# EAGLE design power (EAGLE 9.6.2)
Assembly variants: basic
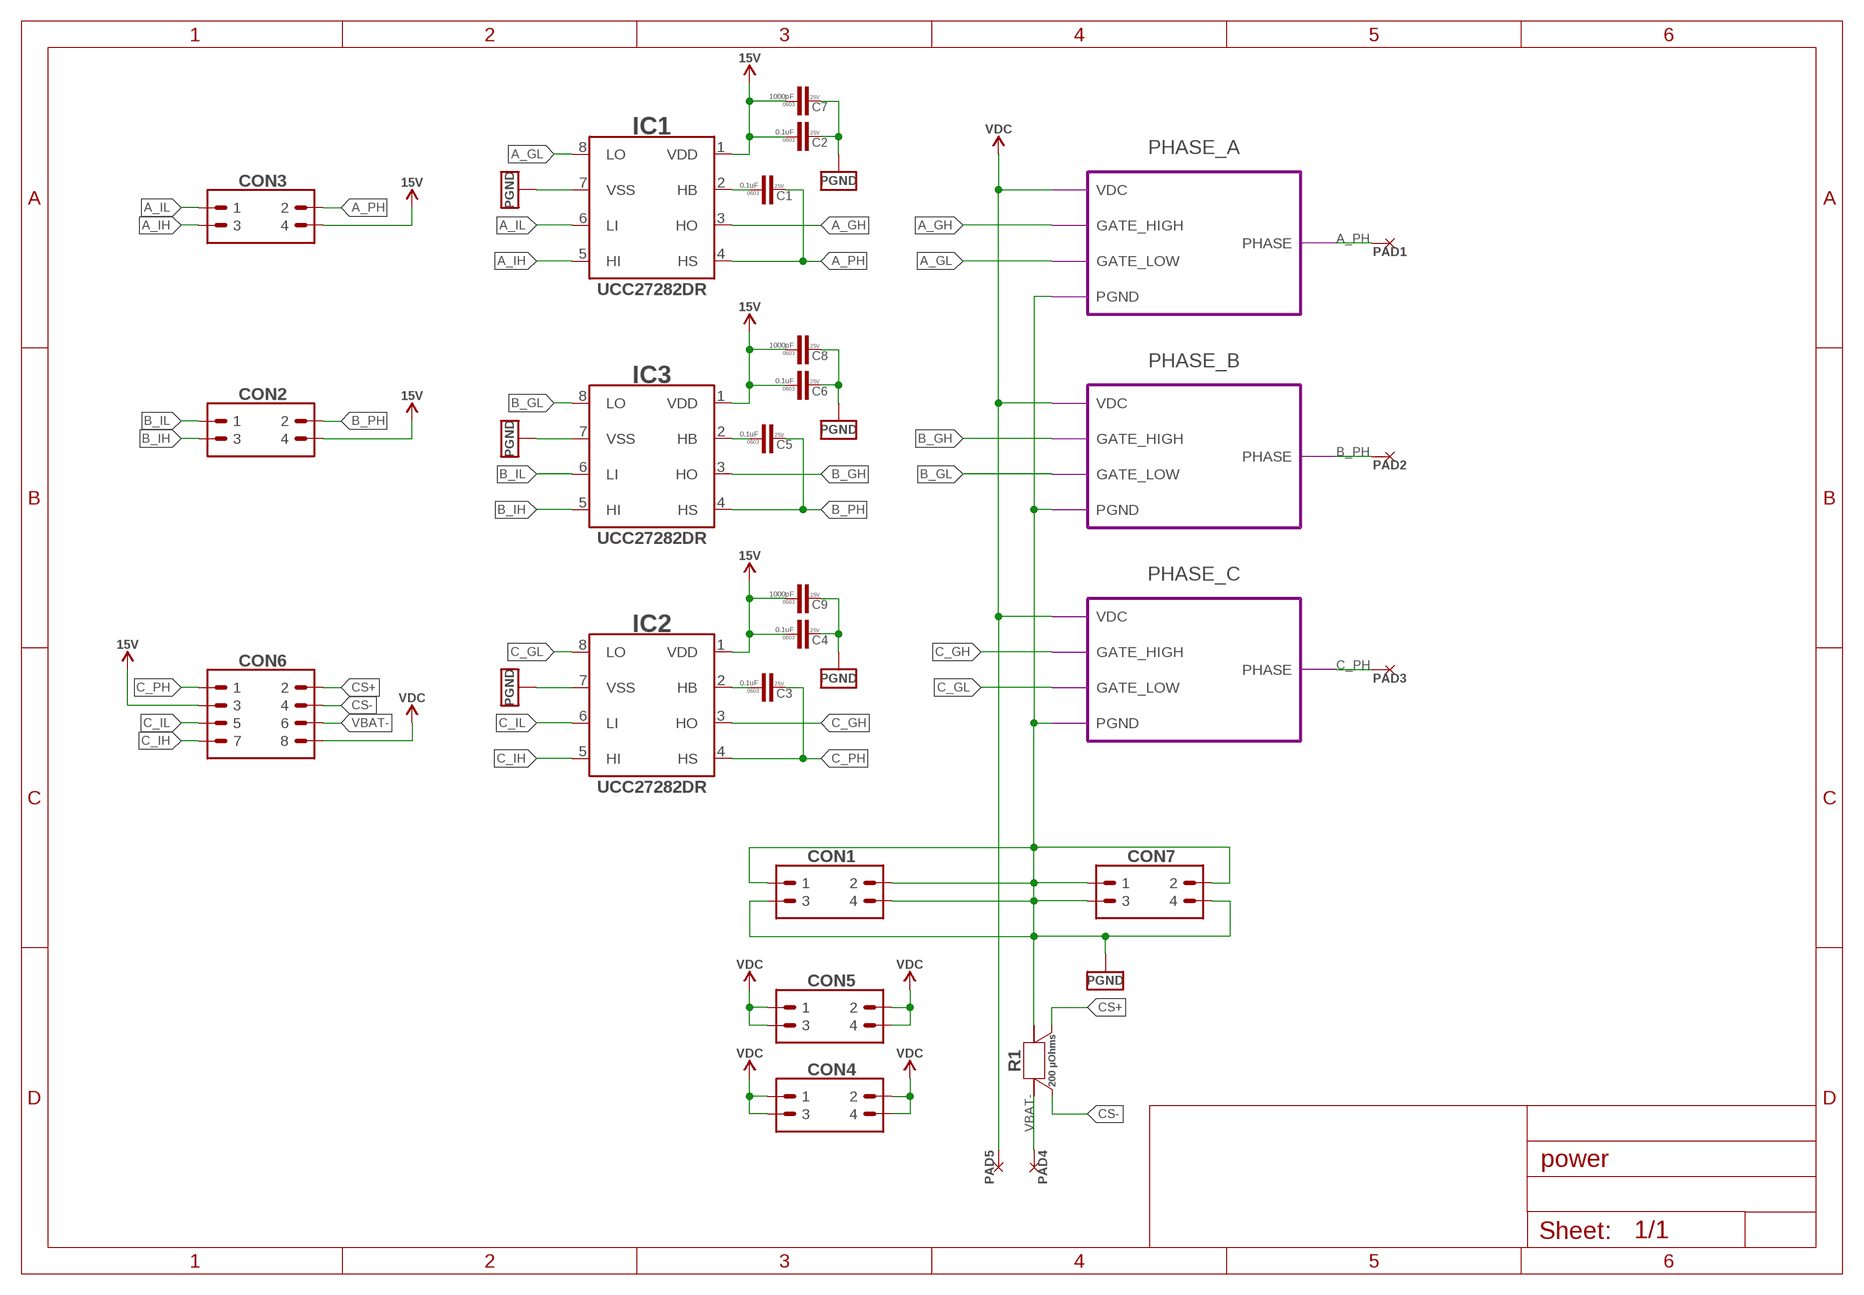
[diagram p0: schematic, sheet 1]

## Parts
C1  0.1uF  C-0603  [C0603]
C2  0.1uF  C-0603  [C0603]
C3  0.1uF  C-0603  [C0603]
C4  0.1uF  C-0603  [C0603]
C5  0.1uF  C-0603  [C0603]
C6  0.1uF  C-0603  [C0603]
C7  1000pF  C-0603  [C0603]
C8  1000pF  C-0603  [C0603]
C9  1000pF  C-0603  [C0603]
CON1  PINHEAD_2X02-0877590414  [2X02-SMD-2-MALE]
CON2  PINHEAD_2X02-0877590414  [2X02-SMD-2-MALE]
CON3  PINHEAD_2X02-0877590414  [2X02-SMD-2-MALE]
CON4  PINHEAD_2X02-0877590414  [2X02-SMD-2-MALE]
CON5  PINHEAD_2X02-0877590414  [2X02-SMD-2-MALE]
CON6  PINHEAD_2X04-SMD-2-MALE  [2X04-SMD-2-MALE]
CON7  PINHEAD_2X02-0877590414  [2X02-SMD-2-MALE]
IC1  UCC27282-SOIC8  [SOIC8]
IC2  UCC27282-SOIC8  [SOIC8]
IC3  UCC27282-SOIC8  [SOIC8]
PAD1  PAD-5X8  [5X8]  (not fitted in variant basic)
PAD2  PAD-5X8  [5X8]  (not fitted in variant basic)
PAD3  PAD-5X8  [5X8]  (not fitted in variant basic)
PAD4  PAD-5X4  [5X4]  (not fitted in variant basic)
PAD5  PAD-5X4  [5X4]  (not fitted in variant basic)
R1  200 µOhms  CURRENT_SHUNT_KELVIN-0.0002R-3920-KELVIN  [R3920-KELVIN]

## Module instances
PHASE_A = PHASE (part numbers offset by 100)
PHASE_B = PHASE (part numbers offset by 200)
PHASE_C = PHASE (part numbers offset by 300)

## Nets
A_GH [HV]: IC1.3(HO) ; port PHASE_A.GATE_HIGH
A_GL: IC1.8(LO) ; port PHASE_A.GATE_LOW
A_IH: CON3.3 IC1.5(HI)
A_IL: CON3.1 IC1.6(LI)
A_PH [HV]: C1.2 CON3.2 IC1.4(HS) PAD1.P$1 ; port PHASE_A.PHASE
B_GH [HV]: IC3.3(HO) ; port PHASE_B.GATE_HIGH
B_GL: IC3.8(LO) ; port PHASE_B.GATE_LOW
B_IH: CON2.3 IC3.5(HI)
B_IL: CON2.1 IC3.6(LI)
B_PH [HV]: C5.2 CON2.2 IC3.4(HS) PAD2.P$1 ; port PHASE_B.PHASE
C_GH [HV]: IC2.3(HO) ; port PHASE_C.GATE_HIGH
C_GL: IC2.8(LO) ; port PHASE_C.GATE_LOW
C_IH: CON6.7 IC2.5(HI)
C_IL: CON6.5 IC2.6(LI)
C_PH [HV]: C3.2 CON6.1 IC2.4(HS) PAD3.P$1 ; port PHASE_C.PHASE
CS+: CON6.2 R1.S2
CS-: CON6.4 R1.S1
N$1: C3.1 IC2.2(HB)
N$2: C5.1 IC3.2(HB)
N$13: C1.1 IC1.2(HB)
PGND: C2.2 C4.2 C6.2 C7.2 C8.2 C9.2 CON1.1 CON1.2 CON1.3 CON1.4 CON7.1 CON7.2 CON7.3 CON7.4 IC1.7(VSS) IC2.7(VSS) IC3.7(VSS) R1.2 R1.22 ; port PHASE_A.PGND PHASE_C.PGND PHASE_B.PGND
VBAT-: CON6.6 PAD4.P$1 R1.1 R1.11
VDC [HV]: CON4.1 CON4.2 CON4.3 CON4.4 CON5.1 CON5.2 CON5.3 CON5.4 CON6.8 PAD5.P$1 ; port PHASE_B.VDC PHASE_A.VDC PHASE_C.VDC
VDD_15V: C2.1 C4.1 C6.1 C7.1 C8.1 C9.1 CON2.4 CON3.4 CON6.3 IC1.1(VDD) IC2.1(VDD) IC3.1(VDD) ; supply symbol labelled 15V

## Library data of the parts
C1-C9 = rc:C; AEC-Q: ---; DIGIKEY#: 1276-1006-1-ND; MANF: Samsung Electro-Mechanics; MANF#: CL10B104KA8NNNC; OPERATING_TEMP: -55°C ~ 125°C; PACKAGE: 0603; VOLTAGE: 25V
CON1-CON5 CON7 = pinhead:PINHEAD_2X02; DIGIKEY#: WM18712-ND; MANF: Molex; MANF#: 0877590414
CON6 = pinhead:PINHEAD_2X04; DIGIKEY#: WM14802-ND; MANF: Molex; MANF#: 0877590814
IC1-IC3 = mosfet_drivers:UCC27282: 3-A, 120-V half bridge gate driver with 5-V UVLO and interlock protections; DIGIKEY#: 296-UCC27282DRCT-ND; MANF: Texas Instruments; MANF#: UCC27282DR
PAD1-PAD3 = PADS:PAD
PAD4 PAD5 = PADS:PAD; BOM: EXCLUDE
R1 = SHUNT_RESISTORS:CURRENT_SHUNT_KELVIN; DIGIKEY#: CSS2H-3920R-L200FCT-ND; LCSC#: C469432; MANF: Bourns Inc; MANF#: CSS2H-3920R-L200FCT-ND; OPERATING_TEMP: -55°C ~ 170°C; PACKAGE: 3920; POWER: 12W; TC: ±50ppm/°C; TOLERANCE: ±1%

## Module PHASE
Ports: GATE_HIGH(in) GATE_LOW(in) PHASE(io) PGND(pwr) VDC(pwr)
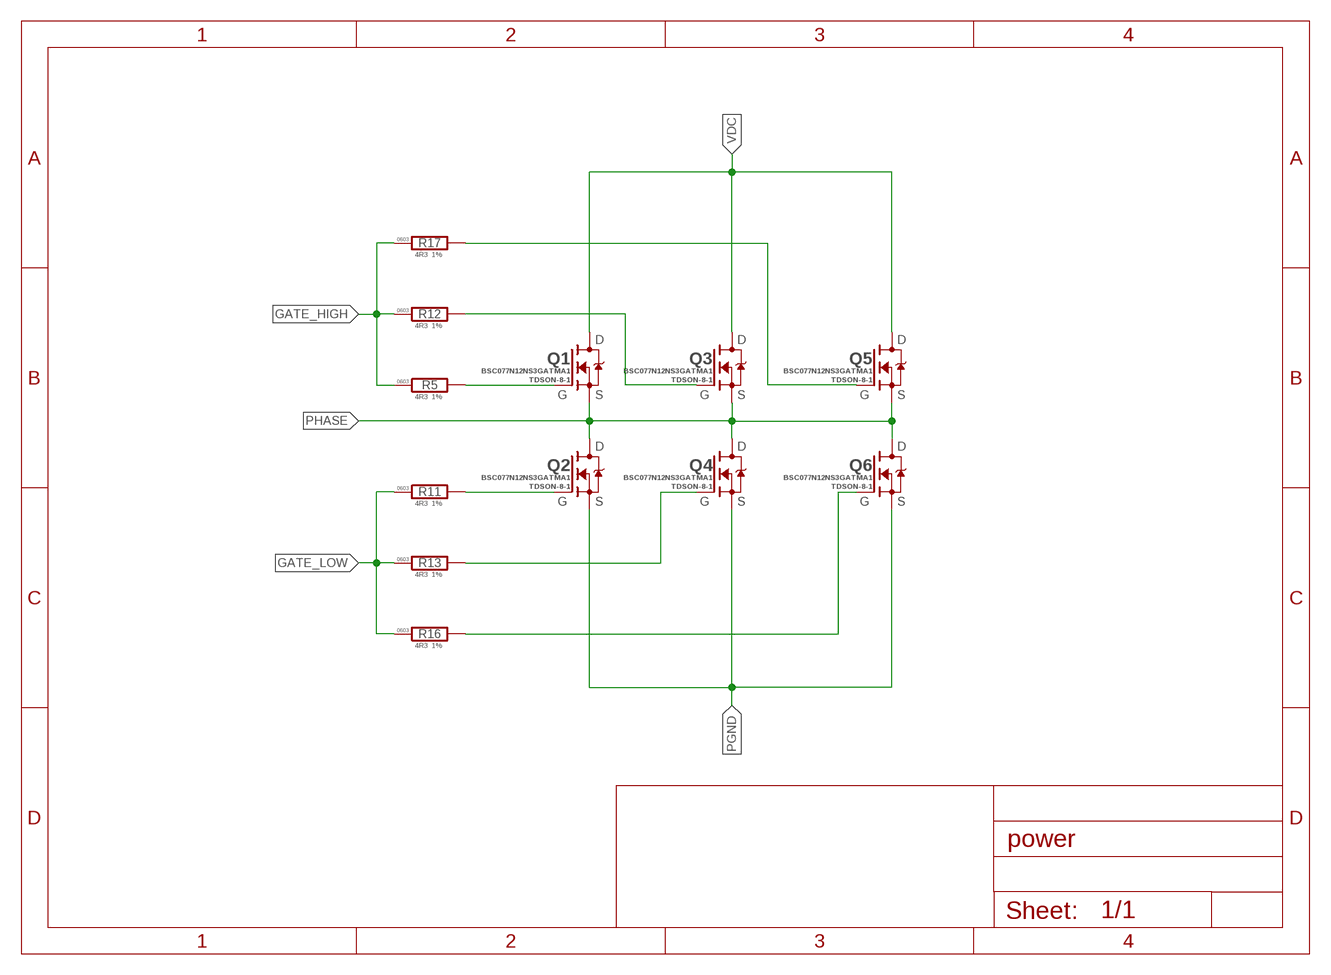
[diagram p1: schematic, module PHASE, sheet 1]

### Parts
Q1  BSC077N12NS3GATMA1  [PG-TDSON-8-1]
Q2  BSC077N12NS3GATMA1  [PG-TDSON-8-1]
Q3  BSC077N12NS3GATMA1  [PG-TDSON-8-1]
Q4  BSC077N12NS3GATMA1  [PG-TDSON-8-1]
Q5  BSC077N12NS3GATMA1  [PG-TDSON-8-1]
Q6  BSC077N12NS3GATMA1  [PG-TDSON-8-1]
R5  4R3  R-1%-0603  [R0603]
R11  4R3  R-1%-0603  [R0603]
R12  4R3  R-1%-0603  [R0603]
R13  4R3  R-1%-0603  [R0603]
R16  4R3  R-1%-0603  [R0603]
R17  4R3  R-1%-0603  [R0603]

### Nets
GATE_HIGH [HV]: R5.1 R12.1 R17.1
GATE_LOW: R11.1 R13.1 R16.1
N$1 [HV]: Q1.4(G) R5.2
N$2: Q2.4(G) R11.2
N$3 [HV]: Q3.4(G) R12.2
N$4: Q4.4(G) R13.2
N$5 [HV]: Q5.4(G) R17.2
N$6: Q6.4(G) R16.2
PGND: Q2.1(S) Q2.2(S) Q2.3(S) Q4.1(S) Q4.2(S) Q4.3(S) Q6.1(S) Q6.2(S) Q6.3(S)
PHASE [HV]: Q1.1(S) Q1.2(S) Q1.3(S) Q2.P$1(D) Q3.1(S) Q3.2(S) Q3.3(S) Q4.P$1(D) Q5.1(S) Q5.2(S) Q5.3(S) Q6.P$1(D)
VDC [HV]: Q1.P$1(D) Q3.P$1(D) Q5.P$1(D)

### Library data of the parts
Q1-Q6 = mosfet:BSC077N12NS3GATMA1: N-Channel 120V 13.4A (Ta), 98A (Tc) 139W (Tc) Surface Mount PG-TDSON-8-1; DIGIKEY#: BSC077N12NS3GATMA1CT-ND; MANF: Infineon Technologies; MANF#: BSC077N12NS3GATMA1; PACKAGE: TDSON-8-1
R5 R11-R13 R16 R17 = rc:R; AEC-Q: AEC-Q200; DIGIKEY#: 10-ERJ-U03F4R30VCT-ND; MANF: Panasonic Electronic Components; MANF#: ERJ-U03F4R30V; OPERATING_TEMP: -55°C ~ 155°C; PACKAGE: 0603; TOLERANCE: 1%

## Net classes
1 HV: clearance 0.4 mm to class 0, clearance 0.4 mm

## Board
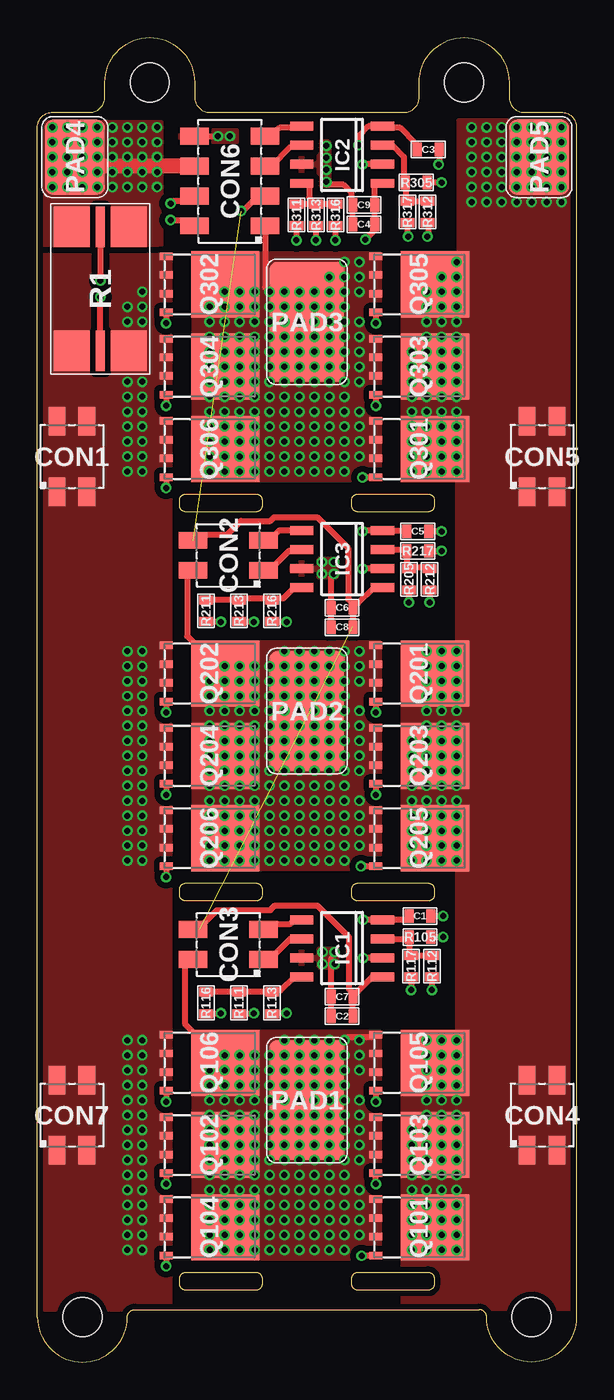
[diagram p2: board, top side]
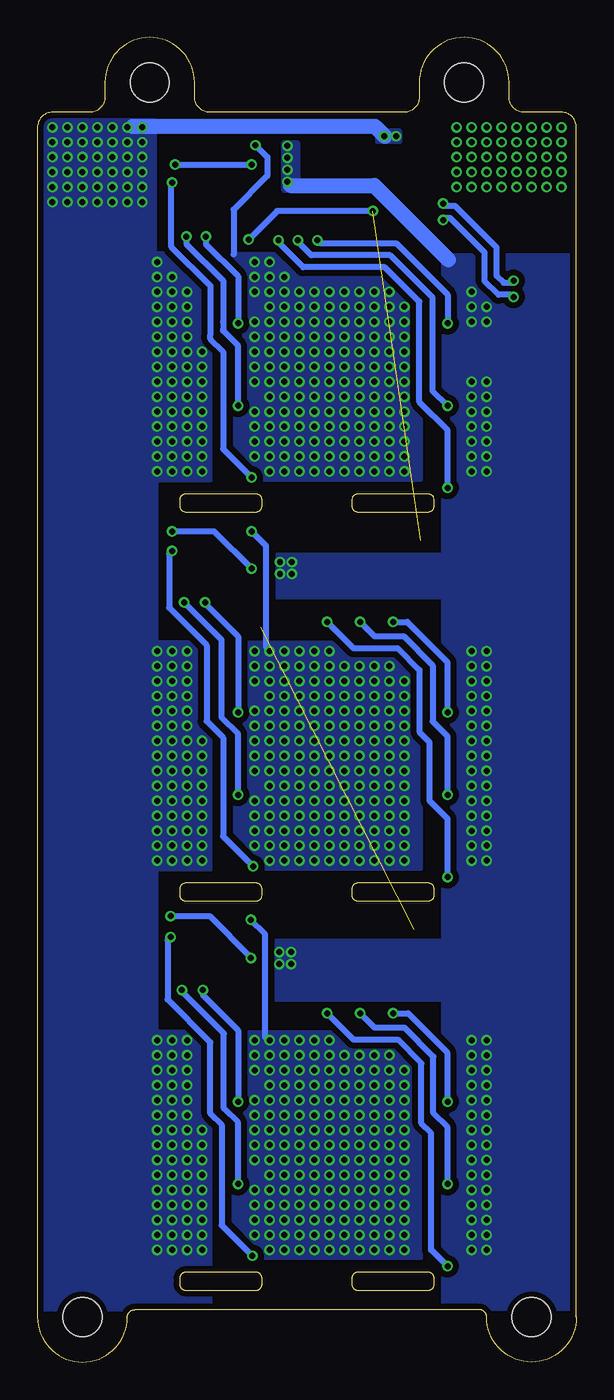
[diagram p3: board, bottom side, seen from below]

Size 36 x 88.5 mm. Coordinates in mm from the lower left corner, seen from the top.
Outline: 30,3 arc90 29.5,3.5 6.5,3.5 arc90 6,3 arc-90 3,0 arc-90 0,3 0,82.5 arc-90 1,83.5 3.5,83.5 arc90 4.5,84.5 4.5,85.5 arc-90 7.5,88.5 arc-90 10.5,85.5 10.5,84.5 arc90 11.5,83.5 24.5,83.5 arc90 25.5,84.5 25.5,85.5 arc-90 28.5,88.5 arc-90 31.5,85.5 31.5,84.5 arc90 32.5,83.5 35,83.5 arc-90 36,82.5 36,3 arc-90 33,0 arc-90 30,3
Outline: 9.9,58 14.6,58 arc-90 15,57.6 15,57.2 arc-90 14.6,56.8 9.9,56.8 arc-90 9.5,57.2 9.5,57.6 arc-90 9.9,58
Outline: 26.5,57.6 26.5,57.2 arc-90 26.1,56.8 21.4,56.8 arc-90 21,57.2 21,57.6 arc-90 21.4,58 26.1,58 arc-90 26.5,57.6
Outline: 9.9,32 14.6,32 arc-90 15,31.6 15,31.2 arc-90 14.6,30.8 9.9,30.8 arc-90 9.5,31.2 9.5,31.6 arc-90 9.9,32
Outline: 26.5,31.6 26.5,31.2 arc-90 26.1,30.8 21.4,30.8 arc-90 21,31.2 21,31.6 arc-90 21.4,32 26.1,32 arc-90 26.5,31.6
Outline: 9.9,6 14.6,6 arc-90 15,5.6 15,5.2 arc-90 14.6,4.8 9.9,4.8 arc-90 9.5,5.2 9.5,5.6 arc-90 9.9,6
Outline: 26.5,5.6 26.5,5.2 arc-90 26.1,4.8 21.4,4.8 arc-90 21,5.2 21,5.6 arc-90 21.4,6 26.1,6 arc-90 26.5,5.6
Copper layers (1*16): Top 0.035mm / dielectric 1mm / Bottom 0.035mm
Design rules "pwrpcb *": minimum track width 0.4mm, minimum drill 0.3mm, track to track 0.4mm, track to pad 0.4mm, pad to pad 0.4mm, via to via 0.4mm, smd to smd 0.15mm, copper to edge 0.4mm, drill to drill 0.4mm, minimum pad ring 0.15mm, minimum via ring 0.15mm, stop-mask expansion 0.41mm, vias tented up to drill 0.41mm, thermal gap 8mil
Holes 2.6 mm at 7.5,85.5 28.5,85.5 3,3 33,3

### Footprints (pad centres in the part's own frame; a part is rotated, then mirrored left to right if it is on the bottom)
C0603 = smd 0.6 x 0.9: 1 -0.725,0; 2 0.725,0
2X02-SMD-2-MALE = smd 1.9 x 1.12: 1 -2.35,1; 2 2.35,1; 3 -2.35,-1; 4 2.35,-1
2X04-SMD-2-MALE = smd 1.9 x 1.12: 1 -2.35,3; 2 2.35,3; 3 -2.35,1; 4 2.35,1; 5 -2.35,-1; 6 2.35,-1; 7 -2.35,-3; 8 2.35,-3
SOIC8 = smd 1.55 x 0.6: 1 -2.7,1.905; 2 -2.7,0.635; 3 -2.7,-0.635; 4 -2.7,-1.905; 5 2.7,-1.905; 6 2.7,-0.635; 7 2.7,0.635; 8 2.7,1.905
5X8 = smd 5 x 8: P$1 0,0
5X4 = smd 5 x 4: P$1 0,0
PG-TDSON-8-1 = smd 0.5 x 0.85: 1 -1.875,-2.9; 2 -0.625,-2.9; 3 0.625,-2.9; 4 1.875,-2.9 | smd 4.41 x 4.55: P$1 0,1.05
R3920-KELVIN = smd 2.7 x 2.4: 1 -4.15,1.9; 2 4.15,1.9; 11 -4.15,-1.9; 22 4.15,-1.9 | smd 2.7 x 0.6: S1 -4.15,0; S2 4.15,0
R0603 = smd 0.6 x 0.9: 1 -0.725,0; 2 0.725,0

### Placement (x,y rotation side)
C1  25.55,29.8 180 top
C2  20.35,23.1 180 top
C3  26.1,81 180 top
C4  21.8,76 180 top
C5  25.4,55.5 180 top
C6  20.35,50.4 180 top
C7  20.35,24.4 180 top
C8  20.35,49.1 180 top
C9  21.8,77.3 180 top
CON1  2.3,60.5 90 top
CON2  12.75,53.9 180 top
CON3  12.75,27.9 180 top
CON4  33.7,16.5 90 top
CON5  33.7,60.5 90 top
CON6  12.85,78.9 180 top
CON7  2.3,16.5 90 top
IC1  20.35,27.65 180 top
IC2  20.35,80.65 180 top
IC3  20.35,53.65 180 top
PAD1  18,17.5 180 top
PAD2  18,43.5 180 top
PAD3  18,69.5 180 top
PAD4  2.5,80.5 270 top
PAD5  33.5,80.5 270 top
Q101  BSC077N12NS3GATMA1  [PG-TDSON-8-1]  25.5,9 270 top
Q102  BSC077N12NS3GATMA1  [PG-TDSON-8-1]  11.5,14.5 270 top
Q103  BSC077N12NS3GATMA1  [PG-TDSON-8-1]  25.5,14.5 270 top
Q104  BSC077N12NS3GATMA1  [PG-TDSON-8-1]  11.5,9 270 top
Q105  BSC077N12NS3GATMA1  [PG-TDSON-8-1]  25.5,20 270 top
Q106  BSC077N12NS3GATMA1  [PG-TDSON-8-1]  11.5,20 270 top
Q201  BSC077N12NS3GATMA1  [PG-TDSON-8-1]  25.5,46 270 top
Q202  BSC077N12NS3GATMA1  [PG-TDSON-8-1]  11.5,46 270 top
Q203  BSC077N12NS3GATMA1  [PG-TDSON-8-1]  25.5,40.5 270 top
Q204  BSC077N12NS3GATMA1  [PG-TDSON-8-1]  11.5,40.5 270 top
Q205  BSC077N12NS3GATMA1  [PG-TDSON-8-1]  25.5,35 270 top
Q206  BSC077N12NS3GATMA1  [PG-TDSON-8-1]  11.5,35 270 top
Q301  BSC077N12NS3GATMA1  [PG-TDSON-8-1]  25.5,61 270 top
Q302  BSC077N12NS3GATMA1  [PG-TDSON-8-1]  11.5,72 270 top
Q303  BSC077N12NS3GATMA1  [PG-TDSON-8-1]  25.5,66.5 270 top
Q304  BSC077N12NS3GATMA1  [PG-TDSON-8-1]  11.5,66.5 270 top
Q305  BSC077N12NS3GATMA1  [PG-TDSON-8-1]  25.5,72 270 top
Q306  BSC077N12NS3GATMA1  [PG-TDSON-8-1]  11.5,61 270 top
R1  4.2,71.7 270 top
R105  4R3  [R0603]  25.55,28.4 0 top
R111  4R3  [R0603]  13.45,24 270 top
R112  4R3  [R0603]  26.35,26.45 270 top
R113  4R3  [R0603]  15.65,24 270 top
R116  4R3  [R0603]  11.25,24 270 top
R117  4R3  [R0603]  24.95,26.45 270 top
R205  4R3  [R0603]  24.8,52.3 270 top
R211  4R3  [R0603]  11.25,50.2 270 top
R212  4R3  [R0603]  26.2,52.3 270 top
R213  4R3  [R0603]  13.45,50.2 270 top
R216  4R3  [R0603]  15.65,50.2 270 top
R217  4R3  [R0603]  25.4,54.2 0 top
R305  4R3  [R0603]  25.3,78.8 0 top
R311  4R3  [R0603]  17.3,76.65 270 top
R312  4R3  [R0603]  26.05,76.85 270 top
R313  4R3  [R0603]  18.6,76.65 270 top
R316  4R3  [R0603]  19.9,76.65 270 top
R317  4R3  [R0603]  24.7,76.85 270 top

### Tracks (layer width: path | path; a pad name or v marks a point on that pad's centre or on a via)
A_GH
  Top 0.4: R112.1 R117.1 24.82,27.3 R105.1 24.71,28.29 IC1.3
A_GL
  Top 0.4: R116.1 R111.1 R113.1 15.75,24.82 16.23,24.82 17.15,25.75 IC1.8
A_IH
  Top 0.4: IC1.5 17.16,29.55 16.85,29.25 15.45,29.25 CON3.3
A_IL
  Top 0.4: CON3.1 15.45,27.25 15.87,27.25 16.9,28.29 IC1.6
A_PH  (via drill 0.4 pad 0.7)
  Top 0.4: CON3.2 9.9,26.9 9.85,26.85 9.85,22.6 12.45,20 Q106.P$1 | v21.75,29.55 IC1.4 24.82,29.55 C1.2 | Q105.1 22.43,21.7 20.7,21.7
  Bottom 0.4: 20.8,21.7 20.8,28.6 v21.75,29.55
  other vias: 20.5,21.5 21.5,21.5 20.5,20.5 21.5,20.5 19.5,20.5 20.5,19.5 21.5,19.5 19.5,19.5 18.5,19.5 17.5,19.5 16.5,19.5 15.5,19.5 14.5,19.5 13.5,19.5 12.5,19.5 20.5,18.5 19.5,18.5 18.5,18.5 17.5,18.5 16.5,18.5 15.5,18.5 14.5,18.5 13.5,18.5 12.5,18.5 11.5,18.5 20.5,17.5 21.5,17.5 19.5,17.5 18.5,17.5 17.5,17.5 16.5,17.5 15.5,17.5 14.5,17.5 13.5,17.5 12.5,17.5 11.5,17.5 20.5,16.5 21.5,16.5 19.5,16.5 18.5,16.5 17.5,16.5 16.5,16.5 15.5,16.5 14.5,16.5 13.5,16.5 12.5,16.5 11.5,16.5 20.5,15.5 21.5,15.5 19.5,15.5 18.5,15.5 17.5,15.5 16.5,15.5 15.5,15.5 14.5,15.5 13.5,15.5 12.5,15.5 11.5,15.5 20.5,8.5 21.5,8.5 19.5,8.5 18.5,8.5 17.5,8.5 16.5,8.5 15.5,8.5 14.5,8.5 13.5,8.5 12.5,8.5 11.5,8.5 20.5,7.5 19.5,7.5 18.5,7.5 17.5,7.5 16.5,7.5 15.5,7.5 14.5,7.5 13.5,7.5 12.5,7.5 11.5,7.5 20.5,11.5 21.5,11.5 19.5,11.5 18.5,11.5 17.5,11.5 16.5,11.5 15.5,11.5 14.5,11.5 13.5,11.5 12.5,11.5 11.5,11.5 20.5,10.5 21.5,10.5 19.5,10.5 18.5,10.5 17.5,10.5 16.5,10.5 15.5,10.5 14.5,10.5 13.5,10.5 12.5,10.5 11.5,10.5 20.5,9.5 21.5,9.5 19.5,9.5 18.5,9.5 17.5,9.5 16.5,9.5 15.5,9.5 14.5,9.5 13.5,9.5 12.5,9.5 11.5,9.5 20.5,14.5 21.5,14.5 19.5,14.5 18.5,14.5 17.5,14.5 16.5,14.5 15.5,14.5 14.5,14.5 13.5,14.5 12.5,14.5 11.5,14.5 20.5,13.5 21.5,13.5 19.5,13.5 18.5,13.5 17.5,13.5 16.5,13.5 15.5,13.5 14.5,13.5 13.5,13.5 12.5,13.5 11.5,13.5 20.5,12.5 19.5,12.5 18.5,12.5 17.5,12.5 16.5,12.5 15.5,12.5 14.5,12.5 13.5,12.5 12.5,12.5 11.5,12.5 18.5,20.5 17.5,20.5 16.5,20.5 15.5,20.5 14.5,20.5 13.5,20.5 12.5,20.5 11.5,19.5 18.5,21.5 17.5,21.5 16.5,21.5 19.5,21.5
  pour Top (no thermals): 10.38,22.1 10.38,6.9 22.93,6.9 22.93,22.1
  pour Bottom (no thermals): 10.38,22.1 10.38,6.9 22.93,6.9 22.93,22.1
B_GH
  Top 0.4: R212.1 26.15,53.08 24.85,53.08 R205.1 24.7,53.02 24.68,53.05 R217.1 24.59,54.28 IC3.3
B_GL
  Top 0.4: R216.1 15.55,51.02 | 15.55,51.02 15,51.02 13.55,51.02 R213.1 R211.1 | IC3.8 17.14,51.74 16.43,51.02 15.55,51.02
B_IH
  Top 0.4: IC3.5 16.16,55.55 15.5,54.9 CON2.3
B_IL
  Top 0.4: CON2.1 15.5,52.9 16.79,54.19 17.55,54.19 IC3.6
B_PH  (via drill 0.4 pad 0.7)
  Top 0.4: CON2.2 10,52.5 10,48.5 12.5,46 Q202.P$1 | C5.2 24.62,55.55 IC3.4 21.75,55.55 v21.7,55.5
  Bottom 0.4: v21.7,55.5 20.75,54.55 20.75,47.8
  other vias: 20.5,47.5 21.5,47.5 20.5,46.5 21.5,46.5 19.5,46.5 20.5,45.5 21.5,45.5 19.5,45.5 18.5,45.5 17.5,45.5 16.5,45.5 15.5,45.5 14.5,45.5 13.5,45.5 12.5,45.5 20.5,44.5 19.5,44.5 18.5,44.5 17.5,44.5 16.5,44.5 15.5,44.5 14.5,44.5 13.5,44.5 12.5,44.5 11.5,44.5 20.5,43.5 21.5,43.5 19.5,43.5 18.5,43.5 17.5,43.5 16.5,43.5 15.5,43.5 14.5,43.5 13.5,43.5 12.5,43.5 11.5,43.5 20.5,42.5 21.5,42.5 19.5,42.5 18.5,42.5 17.5,42.5 16.5,42.5 15.5,42.5 14.5,42.5 13.5,42.5 12.5,42.5 11.5,42.5 20.5,41.5 21.5,41.5 19.5,41.5 18.5,41.5 17.5,41.5 16.5,41.5 15.5,41.5 14.5,41.5 13.5,41.5 12.5,41.5 11.5,41.5 20.5,34.5 21.5,34.5 19.5,34.5 18.5,34.5 17.5,34.5 16.5,34.5 15.5,34.5 14.5,34.5 13.5,34.5 12.5,34.5 11.5,34.5 20.5,33.5 19.5,33.5 18.5,33.5 17.5,33.5 16.5,33.5 15.5,33.5 14.5,33.5 13.5,33.5 12.5,33.5 11.5,33.5 20.5,37.5 21.5,37.5 19.5,37.5 18.5,37.5 17.5,37.5 16.5,37.5 15.5,37.5 14.5,37.5 13.5,37.5 12.5,37.5 11.5,37.5 20.5,36.5 21.5,36.5 19.5,36.5 18.5,36.5 17.5,36.5 16.5,36.5 15.5,36.5 14.5,36.5 13.5,36.5 12.5,36.5 11.5,36.5 20.5,35.5 21.5,35.5 19.5,35.5 18.5,35.5 17.5,35.5 16.5,35.5 15.5,35.5 14.5,35.5 13.5,35.5 12.5,35.5 11.5,35.5 20.5,40.5 21.5,40.5 19.5,40.5 18.5,40.5 17.5,40.5 16.5,40.5 15.5,40.5 14.5,40.5 13.5,40.5 12.5,40.5 11.5,40.5 20.5,39.5 21.5,39.5 19.5,39.5 18.5,39.5 17.5,39.5 16.5,39.5 15.5,39.5 14.5,39.5 13.5,39.5 12.5,39.5 11.5,39.5 20.5,38.5 19.5,38.5 18.5,38.5 17.5,38.5 16.5,38.5 15.5,38.5 14.5,38.5 13.5,38.5 12.5,38.5 11.5,38.5 17.5,46.5 18.5,46.5 19.5,47.5 17.5,47.5 18.5,47.5 16.5,47.5 16.5,46.5 15.5,46.5 14.5,46.5 13.5,46.5 12.5,46.5 11.5,45.5
  pour Top (no thermals): 10.38,48.1 10.38,32.9 22.93,32.9 22.93,48.1
  pour Bottom (no thermals): 10.38,48.1 10.38,32.9 22.93,32.9 22.93,48.1
C_GH
  Top 0.4: IC2.3 23.71,81.28 24.48,80.53 24.48,78.9 R305.1 24.6,78.78 24.6,77.67 R317.1 R312.1
C_GL
  Top 0.4: R316.1 R313.1 | R313.1 R311.1 | R313.1 18.15,77.83 18.15,78.75 IC2.8
C_IH
  Top 0.4: IC2.5 17.55,82.45 16.16,82.45 15.6,81.9 CON6.7
C_IL
  Top 0.4: CON6.5 15.6,79.9 16.89,81.19 17.55,81.19 IC2.6
C_PH  (via drill 0.4 pad 0.7)
  Top 0.4: 22.85,73.92 22.8,73.88 Q305.1 | C3.2 25.27,81.1 25.27,81.4 24.22,82.45 23.15,82.45 IC2.4 22.11,82.56 21.45,81.9 v21.45,81.3 | Q304.P$1 14,66.5 | CON6.1 15.2,71.8 v15.5,71.5
  Bottom 0.4: v21.45,81.3 20.65,80.5 20.65,79.25 22.9,77 22.9,74
  other vias: 20.5,73.5 21.5,73.5 20.5,72.5 21.5,72.5 19.5,72.5 20.5,71.5 21.5,71.5 19.5,71.5 18.5,71.5 17.5,71.5 16.5,71.5 14.5,71.5 13.5,71.5 12.5,71.5 20.5,70.5 19.5,70.5 18.5,70.5 17.5,70.5 16.5,70.5 15.5,70.5 14.5,70.5 13.5,70.5 12.5,70.5 11.5,70.5 20.5,69.5 21.5,69.5 19.5,69.5 18.5,69.5 17.5,69.5 16.5,69.5 15.5,69.5 14.5,69.5 13.5,69.5 12.5,69.5 11.5,69.5 20.5,68.5 21.5,68.5 19.5,68.5 18.5,68.5 17.5,68.5 16.5,68.5 15.5,68.5 14.5,68.5 13.5,68.5 12.5,68.5 11.5,68.5 20.5,67.5 21.5,67.5 19.5,67.5 18.5,67.5 17.5,67.5 16.5,67.5 15.5,67.5 14.5,67.5 13.5,67.5 12.5,67.5 11.5,67.5 20.5,60.5 21.5,60.5 19.5,60.5 18.5,60.5 17.5,60.5 16.5,60.5 15.5,60.5 14.5,60.5 13.5,60.5 12.5,60.5 11.5,60.5 20.5,59.5 19.5,59.5 18.5,59.5 17.5,59.5 16.5,59.5 15.5,59.5 14.5,59.5 13.5,59.5 12.5,59.5 11.5,59.5 20.5,63.5 21.5,63.5 19.5,63.5 18.5,63.5 17.5,63.5 16.5,63.5 15.5,63.5 14.5,63.5 13.5,63.5 12.5,63.5 11.5,63.5 20.5,62.5 21.5,62.5 19.5,62.5 18.5,62.5 17.5,62.5 16.5,62.5 15.5,62.5 14.5,62.5 13.5,62.5 12.5,62.5 11.5,62.5 20.5,61.5 21.5,61.5 19.5,61.5 18.5,61.5 17.5,61.5 16.5,61.5 15.5,61.5 14.5,61.5 13.5,61.5 12.5,61.5 11.5,61.5 20.5,66.5 21.5,66.5 19.5,66.5 18.5,66.5 17.5,66.5 16.5,66.5 15.5,66.5 14.5,66.5 13.5,66.5 12.5,66.5 11.5,66.5 20.5,65.5 21.5,65.5 19.5,65.5 18.5,65.5 17.5,65.5 16.5,65.5 15.5,65.5 14.5,65.5 13.5,65.5 12.5,65.5 11.5,65.5 20.5,64.5 19.5,64.5 18.5,64.5 17.5,64.5 16.5,64.5 15.5,64.5 14.5,64.5 13.5,64.5 12.5,64.5 11.5,64.5
  pour Top (no thermals): 10.38,74.1 10.38,58.9 22.93,58.9 22.93,74.1
  pour Bottom (no thermals): 10.38,74.1 10.38,58.9 22.93,58.9 22.93,74.1
CS+  (via drill 0.4 pad 0.7)
  Top 0.4: R1.S2 v4.2,71.15 | CON6.2 10.15,76.25 8.95,76.25 v8.9,76.3
  Bottom 0.4: v8.9,76.3 8.75,76.45 8.45,76.45 6.15,74.15 6.15,72.25 5.2,71.3 4.35,71.3 v4.2,71.15
CS-  (via drill 0.4 pad 0.7)
  Top 0.4: R1.S1 v4.2,72.25 | CON6.4 10.15,77.55 9.05,77.55 v8.9,77.4
  Bottom 0.4: v8.9,77.4 8.75,77.25 8.12,77.25 5.35,74.48 5.35,72.58 4.87,72.1 4.35,72.1 v4.2,72.25
N$1  (via drill 0.4 pad 0.7)
  Top 0.4: IC2.2 21.71,80.02 v21.7,80 | C3.1 26.82,80.03 v26.8,80
  Bottom 0.4: v26.8,80 v21.7,80
N$2  (via drill 0.4 pad 0.7)
  Top 0.4: IC3.2 23.04,53 v21.7,53 | v27,55.5 C5.1
  Bottom 0.4: v21.7,53 24.2,55.5 v27,55.5
N$13  (via drill 0.4 pad 0.7)
  Top 0.4: IC1.2 21.77,27.02 v21.75,27 | C1.1 v27.1,29.8
  Bottom 0.4: v21.75,27 21.75,27.05 24.5,29.8 v27.1,29.8
PGND  (via drill 0.4 pad 0.7)
  Top 0.4: C2.2 C7.2 19.57,24.3 19.6,24.32 19.6,26.95 | C8.2 C6.2 19.62,52.48 v19.8,52.65 | C4.2 C9.2 20.98,77.4 20.98,78.12 20.45,78.65 19.3,78.65 v19.3,78.85
  Bottom 1: 19.1,78.6 13.5,78.6 8.55,73.65
  other vias: 19.05,27.4 19.3,80.45 19,53.45 19.8,53.45 19,52.65 19.85,27.4 19.05,26.6 19.85,26.6 19.3,81.25 19.3,79.65 7,21.5 7,20.5 7,19.5 7,18.5 7,17.5 7,16.5 7,15.5 7,14.5 7,13.5 7,12.5 7,11.5 7,10.5 7,9.5 7,8.5 7,7.5 6,21.5 6,20.5 6,19.5 6,18.5 6,17.5 6,16.5 6,15.5 6,14.5 6,13.5 6,12.5 6,11.5 6,10.5 6,9.5 6,8.5 6,7.5 7,71.5 7,70.5 7,69.5 7,65.5 7,64.5 7,63.5 7,62.5 7,61.5 7,60.5 7,59.5 6,70.5 6,69.5 6,65.5 6,64.5 6,63.5 6,62.5 6,61.5 6,60.5 6,59.5 7,47.5 7,46.5 7,45.5 7,44.5 7,43.5 7,42.5 7,41.5 7,40.5 7,39.5 7,38.5 7,37.5 7,36.5 7,35.5 7,34.5 7,33.5 6,47.5 6,46.5 6,45.5 6,44.5 6,43.5 6,42.5 6,41.5 6,40.5 6,39.5 6,38.5 6,37.5 6,36.5 6,35.5 6,34.5 6,33.5
  pour Top (no thermals): 8.93,3.5 8.93,74 0,74 0,3.5
  pour Bottom (no thermals): 8.93,3.5 8.93,24.15 20.1,24.15 20.1,28.2 8.93,28.2 8.93,51.05 20.2,51.05 20.2,54 8.93,54 8.93,74 -1,74 -1,3.5
  pour Bottom: 18.65,81.45 18.65,78.3 19.5,78.3 19.5,81.45
  pour Top: 17,53.6 17,52.5 19.95,52.5 19.95,53.6
  pour Top: 17.05,27.55 17.05,26.45 20,26.45 20,27.55
  pour Top: 17.05,81.45 17.05,78.65 19.45,78.65 19.45,81.45
PHASE_A:N$1  (via drill 0.4 pad 0.7)
  Top 0.4: Q101.4 22.57,7.1 v21.65,7.1 | R105.2 v27.1,28.4
  Bottom 0.4: v21.65,7.1 23.7,9.15 23.7,15.85 24.45,16.6 24.45,21.37 27.3,24.22 27.3,28.2 v27.1,28.4
PHASE_A:N$2  (via drill 0.4 pad 0.7)
  Top 0.4: R111.2 13.47,23.3 v14.45,23.3 | Q102.4 v8.6,11.9
  Bottom 0.4: v8.6,11.9 8.6,15.7 9.55,16.65 9.55,20.4 11.5,22.35 13.5,22.35 v14.45,23.3
PHASE_A:N$3  (via drill 0.4 pad 0.7)
  Top 0.4: v22.6,11.9 Q103.4 | R112.2 v26.35,24.85
  Bottom 0.4: v22.6,11.9 22.6,16 23.55,16.95 23.55,21.95 26.35,24.75 v26.35,24.85
PHASE_A:N$4  (via drill 0.4 pad 0.7)
  Top 0.4: R113.2 15.68,23.3 v16.65,23.3 | Q104.4 v8.6,6.4
  Bottom 0.4: v8.6,6.4 9.7,7.5 9.7,15.3 10.35,15.95 10.35,19.95 11.95,21.55 14.9,21.55 v16.65,23.3
PHASE_A:N$5  (via drill 0.4 pad 0.7)
  Top 0.4: Q105.4 v22.6,17.4 | R117.2 v24.95,24.85
  Bottom 0.4: v24.95,24.85 24.95,24.52 22.6,22.18 v22.6,17.4
PHASE_A:N$6  (via drill 0.4 pad 0.7)
  Top 0.4: R116.2 11.28,23.3 v12.25,23.3 | Q106.4 v8.6,17.4
  Bottom 0.4: v8.6,17.4 8.6,20.65 11.25,23.3 v12.25,23.3
PHASE_B:N$1  (via drill 0.4 pad 0.7)
  Top 0.4: Q201.4 v22.6,43.4 | R205.2 v24.8,50.75
  Bottom 0.4: v24.8,50.75 24.8,50.67 22.6,48.48 v22.6,43.4
PHASE_B:N$2  (via drill 0.4 pad 0.7)
  Top 0.4: Q202.4 v8.6,43.4 | v12.25,49.45 11.28,49.45 R211.2
  Bottom 0.4: v8.6,43.4 8.6,46.75 11.3,49.45 v12.25,49.45
PHASE_B:N$3  (via drill 0.4 pad 0.7)
  Top 0.4: Q203.4 v22.6,37.9 | R212.2 v26.2,50.75
  Bottom 0.4: v22.6,37.9 22.6,41.99 23.7,43.07 23.7,48.25 v26.2,50.75
PHASE_B:N$4  (via drill 0.4 pad 0.7)
  Top 0.4: Q204.4 v8.6,37.9 | v14.45,49.45 13.47,49.45 R213.2
  Bottom 0.4: v8.6,37.9 8.6,41.8 9.6,42.8 9.6,46.55 11.55,48.5 13.5,48.5 v14.45,49.45
PHASE_B:N$5  (via drill 0.4 pad 0.7)
  Top 0.4: Q205.4 v21.6,33.12 | R217.2 v27,54.2
  Bottom 0.4: v21.6,33.12 23.6,35.12 23.6,41.73 24.7,42.83 24.7,47.9 27.2,50.4 27.2,54 v27,54.2
PHASE_B:N$6  (via drill 0.4 pad 0.7)
  Top 0.4: Q206.4 v8.6,32.4 | v16.65,49.45 15.68,49.45 R216.2
  Bottom 0.4: v8.6,32.4 8.6,36.3 9.8,37.5 9.8,41.4 10.5,42.1 10.5,46.25 11.95,47.7 14.9,47.7 v16.65,49.45
PHASE_C:N$1  (via drill 0.4 pad 0.7)
  Top 0.4: Q301.4 22.57,59.1 v21.7,59.1 | v27,78.8 R305.2
  Bottom 0.4: v27,78.8 27.05,78.75 27.05,74.5 24.45,71.9 24.45,69.5 24.45,68.65 24.45,68.35 23.6,67.5 23.6,61 v21.7,59.1
PHASE_C:N$2  (via drill 0.4 pad 0.7)
  Top 0.4: R311.2 v17.3,74.95 | Q302.4 v8.6,69.4
  Bottom 0.4: v17.3,74.95 17.1,74.75 12.05,74.75 8.6,71.3 v8.6,69.4
PHASE_C:N$3  (via drill 0.4 pad 0.7)
  Top 0.4: Q303.4 v22.6,63.9 | R312.2 26.1,76.08 26.1,75.25 v26.05,75.2
  Bottom 0.4: v26.05,75.2 26.05,74.7 23.6,72.25 23.6,69.5 23.6,69 23.6,68.9 22.6,67.9 v22.6,63.9
PHASE_C:N$4  (via drill 0.4 pad 0.7)
  Top 0.4: R313.2 v18.6,74.95 | Q304.4 v8.6,63.9
  Bottom 0.4: v8.6,63.9 9.6,64.88 9.6,71.1 12.45,73.95 17.7,73.95 18.6,74.85 v18.6,74.95
PHASE_C:N$5  (via drill 0.4 pad 0.7)
  Top 0.4: v24.75,75.2 24.7,75.25 R317.2 | Q305.4 v22.6,69.4
  Bottom 0.4: v24.75,75.2 24.75,74.7 22.6,72.55 v22.6,69.4
PHASE_C:N$6  (via drill 0.4 pad 0.7)
  Top 0.4: R316.2 v19.9,74.95 | Q306.4 v8.6,58.4
  Bottom 0.4: v8.6,58.4 8.6,62.25 10.5,64.15 10.5,70.85 12.8,73.15 18.25,73.15 19.9,74.8 v19.9,74.95
VBAT-  (via drill 0.4 pad 0.7)
  Top 0.4: 3,79.9 PAD4.P$1
  Top 1: CON6.6 3,79.9
  other vias: 1,82.5 2,82.5 3,82.5 4,82.5 5,82.5 6,82.5 7,82.5 8,82.5 8,81.5 8,80.5 8,79.5 8,78.5 7,78.5 6,78.5 5,78.5 3,78.5 4,78.5 2,78.5 1,78.5 1,79.5 1,80.5 1,81.5 2,81.5 3,81.5 2,80.5 2,79.5 3,79.5 4,79.5 5,79.5 6,79.5 7,79.5 7,80.5 6,80.5 6,81.5 7,81.5 5,81.5 4,81.5 4,80.5 3,80.5 5,80.5
  pour Top (rank 2, no thermals): 0,82.9 8.3,82.9 8.3,74.6 0,74.6
VDC  (via drill 0.4 pad 0.7)
  Top 0.4: CON6.8 v12.05,81.9
  Top 1: PAD5.P$1 32.4,81.6
  Bottom 0.4: v12.05,81.9 12.8,81.9
  Bottom 1: 12.8,81.9 13.45,82.55 29.65,82.55
  other vias: 12.85,81.9 28,72.5 28,73.5 27,72.5 26,71.5 26,70.5 27,70.5 27,71.5 28,71.5 28,70.5 27,69.5 26,69.5 28,69.5 28,68.5 27,68.5 26,68.5 26,67.5 25,67.5 25,66.5 25,65.5 27,67.5 27,66.5 26,66.5 26,65.5 27,65.5 28,65.5 28,66.5 28,67.5 25,64.5 26,64.5 27,64.5 28,64.5 26,63.5 25,63.5 25,62.5 25,61.5 27,63.5 27,62.5 26,62.5 26,61.5 27,61.5 28,61.5 28,62.5 28,63.5 25,60.5 26,60.5 27,60.5 28,60.5 25,59.5 26,59.5 27,59.5 28,59.5 28,46.5 28,47.5 27,46.5 26,45.5 26,44.5 27,44.5 27,45.5 28,45.5 28,44.5 27,43.5 26,43.5 28,43.5 28,42.5 27,42.5 26,42.5 26,41.5 25,41.5 25,40.5 25,39.5 27,41.5 27,40.5 26,40.5 26,39.5 27,39.5 28,39.5 28,40.5 28,41.5 25,38.5 26,38.5 27,38.5 28,38.5 26,37.5 25,37.5 25,36.5 25,35.5 27,37.5 27,36.5 26,36.5 26,35.5 27,35.5 28,35.5 28,36.5 28,37.5 25,34.5 26,34.5 27,34.5 28,34.5 25,33.5 26,33.5 27,33.5 28,33.5 26,46.5 26,47.5 27,47.5 28,20.5 28,21.5 27,20.5 26,19.5 26,18.5 27,18.5 27,19.5 28,19.5 28,18.5 27,17.5 26,17.5 28,17.5 28,16.5 27,16.5 26,16.5 26,15.5 25,15.5 25,14.5 25,13.5 27,15.5 27,14.5 26,14.5 26,13.5 27,13.5 28,13.5 28,14.5 28,15.5 25,12.5 26,12.5 27,12.5 28,12.5 26,11.5 25,11.5 25,10.5 25,9.5 27,11.5 27,10.5 26,10.5 26,9.5 27,9.5 28,9.5 28,10.5 28,11.5 25,8.5 26,8.5 27,8.5 28,8.5 25,7.5 26,7.5 27,7.5 28,7.5 26,20.5 26,21.5 27,21.5 29,82.5 30,82.5 31,82.5 32,82.5 33,82.5 34,82.5 35,82.5 29,81.5 30,81.5 31,81.5 32,81.5 33,81.5 34,81.5 35,81.5 29,80.5 30,80.5 31,80.5 32,80.5 33,80.5 34,80.5 35,80.5 29,79.5 30,79.5 31,79.5 32,79.5 33,79.5 34,79.5 35,79.5 29,78.5 30,78.5 31,78.5 32,78.5 33,78.5 34,78.5 35,78.5 29,77.5 30,77.5 31,77.5 32,77.5 33,77.5 34,77.5 35,77.5
  pour Top (no thermals): 24.38,3.5 24.38,22.1 28,22.1 28,32.9 24.38,32.9 24.38,48.1 28,48.1 28,58.9 24.38,58.9 24.38,74.1 28.1,74.1 28.1,83 36,83 36,3.5
  pour Bottom (no thermals): 24.38,3.5 24.38,22.1 28,22.1 28,32.9 24.38,32.9 24.38,48.1 28,48.1 28,58.9 24.38,58.9 24.38,74.1 28.1,74.1 28.1,83 37,83 37,3.5
  pour Top: 9.6,82.25 13.25,82.25 13.25,81.55 9.6,81.55
  pour Bottom: 13.25,82.25 11.85,82.25 11.85,81.55 13.25,81.55
VDD_15V  (via drill 0.4 pad 0.7)  (2 unrouted)
  Top 0.4: CON2.4 10.75,55.25 12.65,55.25 13.59,56.2 15.55,56.2 15.81,56.45 18.67,56.45 20.75,54.38 20.75,50.98 21.02,50.7 | 10.85,28.9 CON3.4 10.7,28.9 12,30.2 15.55,30.2 15.86,30.5 18.7,30.5 20.8,28.4 20.8,24.9 21.11,24.59 | CON6.3 14.7,77.9 13.7,76.9 v13.6,76.9 | C2.1 C7.1 21.02,24.5 21.11,24.59 | 21.11,24.59 21.16,24.64 21.21,24.59 22.37,25.75 IC1.1 | 21.02,50.7 21.07,50.65 C6.1 C8.1 | IC3.1 22.45,51.74 21.41,50.7 21.02,50.7 | IC2.1 22.55,78.75 22.52,78.72 C9.1 C4.1 22.52,75.62 v21.9,75
  Bottom 0.4: v13.6,76.9 20,76.9 v21.9,75